# EAGLE schematic Short-round to Regular Header (EAGLE 6.5.0)
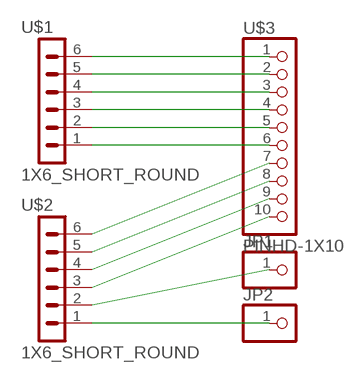
[diagram p0: schematic, sheet 1]

## Parts
JP1  PINHD-1X1  [1X01]
JP2  PINHD-1X1  [1X01]
U$1  1X6_SHORT_ROUND  [1X6_SHORT_ROUND]
U$2  1X6_SHORT_ROUND  [1X6_SHORT_ROUND]
U$3  PINHD-1X10  [1X10-BIG]

## Nets
N$1: U$1.6 U$3.1
N$2: U$1.5 U$3.2
N$3: U$1.4 U$3.3
N$4: U$1.3 U$3.4
N$5: U$1.2 U$3.5
N$6: U$1.1 U$3.6
N$7: U$2.6 U$3.7
N$8: U$2.5 U$3.8
N$9: U$2.4 U$3.9
N$10: U$2.3 U$3.10
N$11: JP1.1 U$2.2
N$12: JP2.1 U$2.1

## Library data of the parts
JP1 JP2 = adafruit:PINHD-1X1: Pin header 1x1 for 0.1" spacing With round pins
U$1 U$2 = Random parts(01-14-14):1X6_SHORT_ROUND
U$3 = adafruit:PINHD-1X10: Pin header 1x10 0.1" spacing With round pins